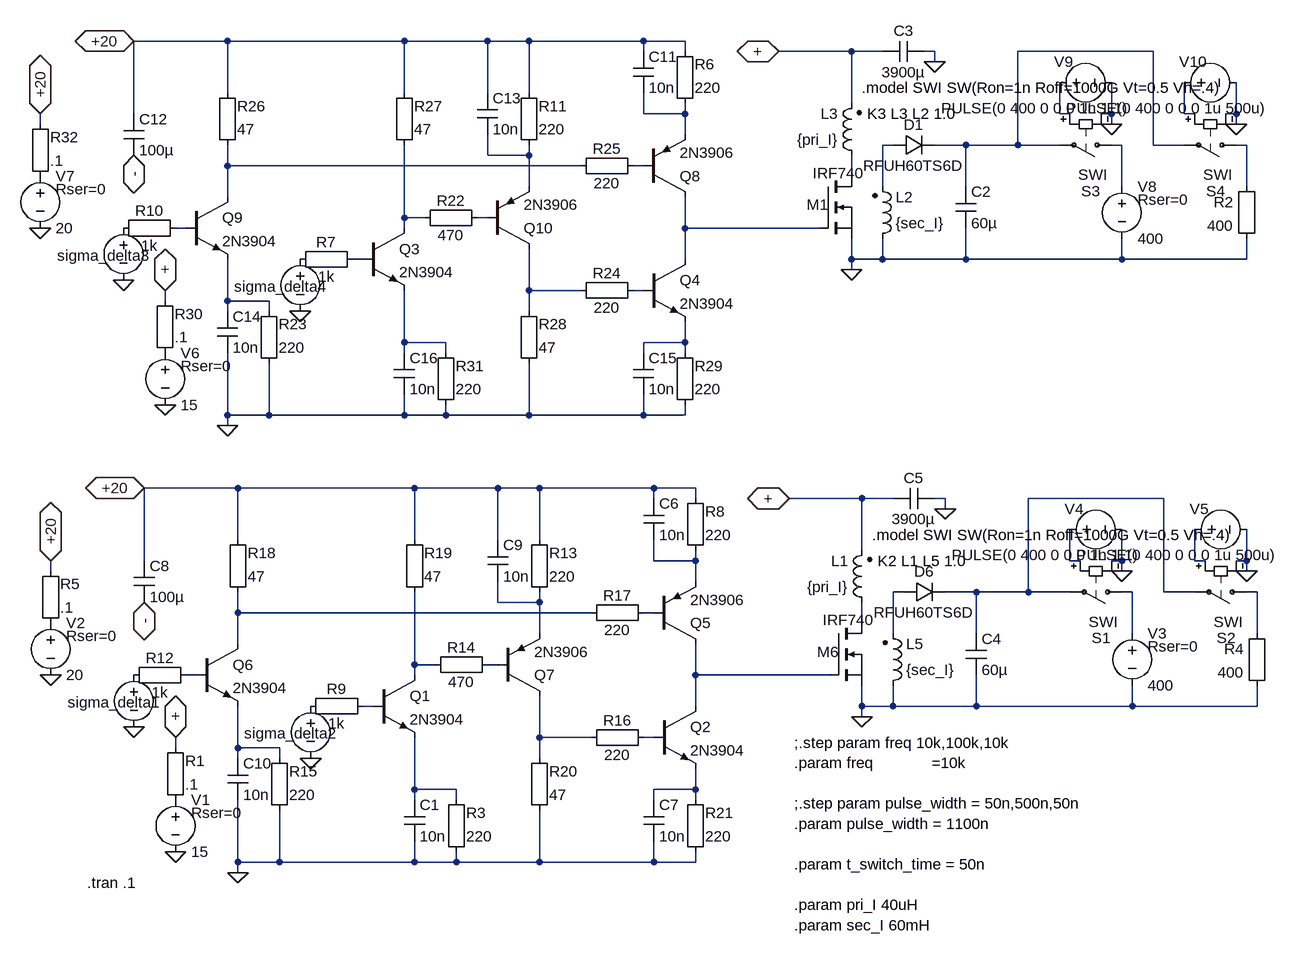
[diagram p0: schematic metal_SMPS_400v_60%_10khz_10.asc]
metal_SMPS_400v_60%_10khz_10.asc, the LTspice schematic file:
Version 4
SHEET 1 6068 1612
WIRE 2272 -3264 2128 -3264
WIRE 2544 -3264 2272 -3264
WIRE 2672 -3264 2544 -3264
WIRE 2736 -3264 2672 -3264
WIRE 2912 -3264 2736 -3264
WIRE 2976 -3264 2912 -3264
WIRE 2912 -3248 2912 -3264
WIRE 2976 -3248 2976 -3264
WIRE 3232 -3248 3120 -3248
WIRE 3280 -3248 3232 -3248
WIRE 3360 -3248 3344 -3248
WIRE 3696 -3248 3488 -3248
WIRE 3360 -3232 3360 -3248
WIRE 2272 -3184 2272 -3264
WIRE 2544 -3184 2544 -3264
WIRE 2672 -3184 2672 -3264
WIRE 2736 -3184 2736 -3264
WIRE 3232 -3168 3232 -3248
WIRE 2128 -3152 2128 -3264
WIRE 2912 -3152 2912 -3184
WIRE 2976 -3152 2976 -3168
WIRE 2976 -3152 2912 -3152
WIRE 3552 -3152 3552 -3200
WIRE 3568 -3152 3552 -3152
WIRE 3632 -3152 3632 -3200
WIRE 3632 -3152 3616 -3152
WIRE 3744 -3152 3744 -3200
WIRE 3760 -3152 3744 -3152
WIRE 3824 -3152 3824 -3200
WIRE 3824 -3152 3808 -3152
WIRE 1984 -3136 1984 -3152
WIRE 3632 -3136 3632 -3152
WIRE 3824 -3136 3824 -3152
WIRE 2976 -3120 2976 -3152
WIRE 3296 -3104 3280 -3104
WIRE 3408 -3104 3360 -3104
WIRE 3488 -3104 3488 -3248
WIRE 3488 -3104 3408 -3104
WIRE 3552 -3104 3488 -3104
WIRE 3648 -3104 3632 -3104
WIRE 3696 -3104 3696 -3248
WIRE 3744 -3104 3696 -3104
WIRE 3840 -3104 3824 -3104
WIRE 2672 -3088 2672 -3120
WIRE 2736 -3088 2736 -3104
WIRE 2736 -3088 2672 -3088
WIRE 2272 -3072 2272 -3104
WIRE 2816 -3072 2272 -3072
WIRE 2912 -3072 2896 -3072
WIRE 3232 -3056 3232 -3088
WIRE 2736 -3040 2736 -3088
WIRE 3280 -3040 3280 -3104
WIRE 3408 -3040 3408 -3104
WIRE 3648 -3040 3648 -3104
WIRE 3840 -3040 3840 -3104
WIRE 2272 -3024 2272 -3072
WIRE 2544 -2992 2544 -3104
WIRE 2576 -2992 2544 -2992
WIRE 2672 -2992 2656 -2992
WIRE 2208 -2976 2192 -2976
WIRE 2544 -2976 2544 -2992
WIRE 2976 -2976 2976 -3024
WIRE 3184 -2976 2976 -2976
WIRE 2480 -2928 2464 -2928
WIRE 2976 -2928 2976 -2976
WIRE 3232 -2928 3232 -2960
WIRE 3280 -2928 3280 -2960
WIRE 3280 -2928 3232 -2928
WIRE 3408 -2928 3408 -2976
WIRE 3408 -2928 3280 -2928
WIRE 3648 -2928 3648 -2960
WIRE 3648 -2928 3408 -2928
WIRE 3840 -2928 3840 -2960
WIRE 3840 -2928 3648 -2928
WIRE 3232 -2912 3232 -2928
WIRE 2736 -2880 2736 -2944
WIRE 2816 -2880 2736 -2880
WIRE 2912 -2880 2896 -2880
WIRE 2176 -2864 2176 -2880
WIRE 2272 -2864 2272 -2928
WIRE 2336 -2864 2272 -2864
WIRE 2272 -2848 2272 -2864
WIRE 2336 -2848 2336 -2864
WIRE 2736 -2848 2736 -2880
WIRE 2544 -2800 2544 -2880
WIRE 2608 -2800 2544 -2800
WIRE 2976 -2800 2976 -2832
WIRE 2976 -2800 2912 -2800
WIRE 2544 -2784 2544 -2800
WIRE 2608 -2784 2608 -2800
WIRE 2912 -2784 2912 -2800
WIRE 2976 -2784 2976 -2800
WIRE 2272 -2688 2272 -2784
WIRE 2336 -2688 2336 -2768
WIRE 2336 -2688 2272 -2688
WIRE 2544 -2688 2544 -2720
WIRE 2544 -2688 2336 -2688
WIRE 2608 -2688 2608 -2704
WIRE 2608 -2688 2544 -2688
WIRE 2736 -2688 2736 -2768
WIRE 2736 -2688 2608 -2688
WIRE 2912 -2688 2912 -2720
WIRE 2912 -2688 2736 -2688
WIRE 2976 -2688 2976 -2704
WIRE 2976 -2688 2912 -2688
WIRE 2272 -2672 2272 -2688
WIRE 2288 -2576 2144 -2576
WIRE 2560 -2576 2288 -2576
WIRE 2688 -2576 2560 -2576
WIRE 2752 -2576 2688 -2576
WIRE 2928 -2576 2752 -2576
WIRE 2992 -2576 2928 -2576
WIRE 2928 -2560 2928 -2576
WIRE 2992 -2560 2992 -2576
WIRE 3248 -2560 3136 -2560
WIRE 3296 -2560 3248 -2560
WIRE 3376 -2560 3360 -2560
WIRE 3712 -2560 3504 -2560
WIRE 3376 -2544 3376 -2560
WIRE 2288 -2496 2288 -2576
WIRE 2560 -2496 2560 -2576
WIRE 2688 -2496 2688 -2576
WIRE 2752 -2496 2752 -2576
WIRE 3248 -2480 3248 -2560
WIRE 2144 -2464 2144 -2576
WIRE 2928 -2464 2928 -2496
WIRE 2992 -2464 2992 -2480
WIRE 2992 -2464 2928 -2464
WIRE 3568 -2464 3568 -2512
WIRE 3584 -2464 3568 -2464
WIRE 3648 -2464 3648 -2512
WIRE 3648 -2464 3632 -2464
WIRE 3760 -2464 3760 -2512
WIRE 3776 -2464 3760 -2464
WIRE 3840 -2464 3840 -2512
WIRE 3840 -2464 3824 -2464
WIRE 2000 -2448 2000 -2464
WIRE 3648 -2448 3648 -2464
WIRE 3840 -2448 3840 -2464
WIRE 2992 -2432 2992 -2464
WIRE 3312 -2416 3296 -2416
WIRE 3424 -2416 3376 -2416
WIRE 3504 -2416 3504 -2560
WIRE 3504 -2416 3424 -2416
WIRE 3568 -2416 3504 -2416
WIRE 3664 -2416 3648 -2416
WIRE 3712 -2416 3712 -2560
WIRE 3760 -2416 3712 -2416
WIRE 3856 -2416 3840 -2416
WIRE 2688 -2400 2688 -2432
WIRE 2752 -2400 2752 -2416
WIRE 2752 -2400 2688 -2400
WIRE 2288 -2384 2288 -2416
WIRE 2832 -2384 2288 -2384
WIRE 2928 -2384 2912 -2384
WIRE 3248 -2368 3248 -2400
WIRE 2752 -2352 2752 -2400
WIRE 3296 -2352 3296 -2416
WIRE 3424 -2352 3424 -2416
WIRE 3664 -2352 3664 -2416
WIRE 3856 -2352 3856 -2416
WIRE 2288 -2336 2288 -2384
WIRE 2560 -2304 2560 -2416
WIRE 2592 -2304 2560 -2304
WIRE 2688 -2304 2672 -2304
WIRE 2224 -2288 2208 -2288
WIRE 2560 -2288 2560 -2304
WIRE 2992 -2288 2992 -2336
WIRE 3200 -2288 2992 -2288
WIRE 2496 -2240 2480 -2240
WIRE 2992 -2240 2992 -2288
WIRE 3248 -2240 3248 -2272
WIRE 3296 -2240 3296 -2272
WIRE 3296 -2240 3248 -2240
WIRE 3424 -2240 3424 -2288
WIRE 3424 -2240 3296 -2240
WIRE 3664 -2240 3664 -2272
WIRE 3664 -2240 3424 -2240
WIRE 3856 -2240 3856 -2272
WIRE 3856 -2240 3664 -2240
WIRE 3248 -2224 3248 -2240
WIRE 2752 -2192 2752 -2256
WIRE 2832 -2192 2752 -2192
WIRE 2928 -2192 2912 -2192
WIRE 2192 -2176 2192 -2192
WIRE 2288 -2176 2288 -2240
WIRE 2352 -2176 2288 -2176
WIRE 2288 -2160 2288 -2176
WIRE 2352 -2160 2352 -2176
WIRE 2752 -2160 2752 -2192
WIRE 2560 -2112 2560 -2192
WIRE 2624 -2112 2560 -2112
WIRE 2992 -2112 2992 -2144
WIRE 2992 -2112 2928 -2112
WIRE 2560 -2096 2560 -2112
WIRE 2624 -2096 2624 -2112
WIRE 2928 -2096 2928 -2112
WIRE 2992 -2096 2992 -2112
WIRE 2288 -2000 2288 -2096
WIRE 2352 -2000 2352 -2080
WIRE 2352 -2000 2288 -2000
WIRE 2560 -2000 2560 -2032
WIRE 2560 -2000 2352 -2000
WIRE 2624 -2000 2624 -2016
WIRE 2624 -2000 2560 -2000
WIRE 2752 -2000 2752 -2080
WIRE 2752 -2000 2624 -2000
WIRE 2928 -2000 2928 -2032
WIRE 2928 -2000 2752 -2000
WIRE 2992 -2000 2992 -2016
WIRE 2992 -2000 2928 -2000
WIRE 2288 -1984 2288 -2000
FLAG 3248 -2224 0
FLAG 3376 -2544 0
FLAG 3136 -2560 +
IOPIN 3136 -2560 BiDir
FLAG 2144 -2400 -
IOPIN 2144 -2400 BiDir
FLAG 2400 -2160 0
FLAG 2128 -2208 0
FLAG 2144 -2576 +20
IOPIN 2144 -2576 BiDir
FLAG 2288 -1984 0
FLAG 2192 -2192 +
IOPIN 2192 -2192 BiDir
FLAG 2192 -2016 0
FLAG 2000 -2464 +20
IOPIN 2000 -2464 BiDir
FLAG 2000 -2288 0
FLAG 3648 -2448 0
FLAG 3840 -2448 0
FLAG 3232 -2912 0
FLAG 3360 -3232 0
FLAG 3120 -3248 +
IOPIN 3120 -3248 BiDir
FLAG 2128 -3088 -
IOPIN 2128 -3088 BiDir
FLAG 2384 -2848 0
FLAG 2112 -2896 0
FLAG 2128 -3264 +20
IOPIN 2128 -3264 BiDir
FLAG 2272 -2672 0
FLAG 2176 -2880 +
IOPIN 2176 -2880 BiDir
FLAG 2176 -2704 0
FLAG 1984 -3152 +20
IOPIN 1984 -3152 BiDir
FLAG 1984 -2976 0
FLAG 3632 -3136 0
FLAG 3824 -3136 0
SYMBOL ind2 3280 -2256 M180
WINDOW 0 36 80 Left 2
WINDOW 3 36 40 Left 2
SYMATTR InstName L5
SYMATTR Value {sec_I}
SYMATTR SpiceLine Rser=.42
SYMATTR Type ind
SYMBOL diode 3312 -2400 R270
WINDOW 0 32 32 VTop 2
WINDOW 3 0 32 VBottom 2
SYMATTR InstName D6
SYMATTR Value RFUH60TS6D
SYMBOL Misc\\EuropeanCap 3408 -2352 R0
SYMATTR InstName C4
SYMATTR Value 60µ
SYMBOL Misc\\EuropeanResistor 3872 -2368 M0
SYMATTR InstName R4
SYMATTR Value 400
SYMBOL nmos 3200 -2368 R0
WINDOW 0 -21 44 Left 2
WINDOW 3 -12 -5 Left 2
SYMATTR InstName M6
SYMATTR Value IRF740
SYMBOL ind2 3264 -2384 R180
WINDOW 0 36 80 Left 2
WINDOW 3 36 40 Left 2
SYMATTR InstName L1
SYMATTR Value {pri_I}
SYMATTR SpiceLine Rser=.0003
SYMATTR Type ind
SYMBOL Misc\\EuropeanCap 3360 -2576 R90
WINDOW 0 0 32 VBottom 2
WINDOW 3 32 32 VTop 2
SYMATTR InstName C5
SYMATTR Value 3900µ
SYMATTR SpiceLine Rser=.005
SYMBOL Misc\\EuropeanCap 2912 -2560 R0
SYMATTR InstName C6
SYMATTR Value 10n
SYMATTR SpiceLine V=400 Irms=1 Rser=.32 Lser=0
SYMBOL Misc\\EuropeanResistor 2976 -2464 M180
WINDOW 0 31 76 Left 2
WINDOW 3 31 40 Left 2
SYMATTR InstName R8
SYMATTR Value 220
SYMBOL Misc\\EuropeanCap 2128 -2464 R0
SYMATTR InstName C8
SYMATTR Value 100µ
SYMATTR SpiceLine V=400 Irms=1 Rser=.32 Lser=0
SYMBOL npn3 2496 -2288 R0
SYMATTR InstName Q1
SYMATTR Value 2N3904
SYMBOL Misc\\EuropeanResistor 2384 -2256 M90
WINDOW 0 5 56 VBottom 2
WINDOW 3 27 56 VTop 2
SYMATTR InstName R9
SYMATTR Value 1k
SYMBOL npn3 2928 -2240 R0
SYMATTR InstName Q2
SYMATTR Value 2N3904
SYMBOL pnp2 2928 -2336 M180
SYMATTR InstName Q5
SYMATTR Value 2N3906
SYMBOL npn3 2224 -2336 R0
SYMATTR InstName Q6
SYMATTR Value 2N3904
SYMBOL Misc\\EuropeanResistor 2112 -2304 M90
WINDOW 0 5 56 VBottom 2
WINDOW 3 27 56 VTop 2
SYMATTR InstName R12
SYMATTR Value 1k
SYMBOL pnp2 2688 -2256 M180
SYMATTR InstName Q7
SYMATTR Value 2N3906
SYMBOL Misc\\EuropeanResistor 2736 -2400 M180
WINDOW 0 31 76 Left 2
WINDOW 3 31 40 Left 2
SYMATTR InstName R13
SYMATTR Value 220
SYMBOL Misc\\EuropeanResistor 2576 -2320 M90
WINDOW 0 5 56 VBottom 2
WINDOW 3 27 56 VTop 2
SYMATTR InstName R14
SYMATTR Value 470
SYMBOL Misc\\EuropeanCap 2672 -2496 R0
SYMATTR InstName C9
SYMATTR Value 10n
SYMATTR SpiceLine V=400 Irms=1 Rser=.32 Lser=0
SYMBOL Misc\\EuropeanResistor 2336 -2064 M180
WINDOW 0 31 76 Left 2
WINDOW 3 31 40 Left 2
SYMATTR InstName R15
SYMATTR Value 220
SYMBOL Misc\\EuropeanCap 2272 -2160 R0
SYMATTR InstName C10
SYMATTR Value 10n
SYMATTR SpiceLine V=400 Irms=1 Rser=.32 Lser=0
SYMBOL Misc\\EuropeanResistor 2928 -2176 M270
WINDOW 0 27 56 VTop 2
WINDOW 3 5 56 VBottom 2
SYMATTR InstName R16
SYMATTR Value 220
SYMBOL Misc\\EuropeanResistor 2816 -2400 M90
WINDOW 0 5 56 VBottom 2
WINDOW 3 27 56 VTop 2
SYMATTR InstName R17
SYMATTR Value 220
SYMBOL Misc\\EuropeanResistor 2272 -2400 M180
WINDOW 0 31 76 Left 2
WINDOW 3 31 40 Left 2
SYMATTR InstName R18
SYMATTR Value 47
SYMBOL Misc\\EuropeanResistor 2544 -2400 M180
WINDOW 0 31 76 Left 2
WINDOW 3 31 40 Left 2
SYMATTR InstName R19
SYMATTR Value 47
SYMBOL Misc\\EuropeanResistor 2736 -2064 M180
WINDOW 0 31 76 Left 2
WINDOW 3 31 40 Left 2
SYMATTR InstName R20
SYMATTR Value 47
SYMBOL Misc\\EuropeanCap 2912 -2096 R0
SYMATTR InstName C7
SYMATTR Value 10n
SYMATTR SpiceLine V=400 Irms=1 Rser=.32 Lser=0
SYMBOL Misc\\EuropeanResistor 2976 -2000 M180
WINDOW 0 31 76 Left 2
WINDOW 3 31 40 Left 2
SYMATTR InstName R21
SYMATTR Value 220
SYMBOL voltage 2128 -2304 M0
WINDOW 0 -42 58 Left 2
WINDOW 3 -134 119 Invisible 2
WINDOW 123 0 0 Left 2
SYMATTR InstName sigma_delta1
SYMATTR Value PULSE(0 5 0 10n 10n {t_switch_time} {1/freq})
SYMATTR SpiceLine Rser=0
SYMBOL voltage 2400 -2256 M0
WINDOW 0 -42 58 Left 2
WINDOW 3 -134 119 Invisible 2
WINDOW 123 0 0 Left 2
SYMATTR InstName sigma_delta2
SYMATTR Value PULSE(0 5 {pulse_width} 10n 10n {t_switch_time} {1/freq})
SYMATTR SpiceLine Rser=0
SYMBOL voltage 2192 -2112 R0
WINDOW 123 0 0 Left 2
WINDOW 39 24 36 Left 2
SYMATTR SpiceLine Rser=0
SYMATTR InstName V1
SYMATTR Value 15
SYMBOL Misc\\EuropeanResistor 2176 -2080 M180
WINDOW 0 31 76 Left 2
WINDOW 3 31 40 Left 2
SYMATTR InstName R1
SYMATTR Value .1
SYMBOL Misc\\EuropeanResistor 2608 -2000 M180
WINDOW 0 31 76 Left 2
WINDOW 3 31 40 Left 2
SYMATTR InstName R3
SYMATTR Value 220
SYMBOL Misc\\EuropeanCap 2544 -2096 R0
SYMATTR InstName C1
SYMATTR Value 10n
SYMATTR SpiceLine V=400 Irms=1 Rser=.32 Lser=0
SYMBOL voltage 2000 -2384 R0
WINDOW 123 0 0 Left 2
WINDOW 39 24 36 Left 2
SYMATTR SpiceLine Rser=0
SYMATTR InstName V2
SYMATTR Value 20
SYMBOL Misc\\EuropeanResistor 1984 -2352 M180
WINDOW 0 31 76 Left 2
WINDOW 3 31 40 Left 2
SYMATTR InstName R5
SYMATTR Value .1
SYMBOL sw 3664 -2416 R90
WINDOW 0 71 33 VRight 2
WINDOW 38 46 22 VRight 2
SYMATTR InstName S1
SYMATTR SpiceModel SWI
SYMATTR Value ""
SYMBOL voltage 3664 -2368 R0
WINDOW 123 0 0 Left 2
WINDOW 39 24 36 Left 2
SYMATTR SpiceLine Rser=0
SYMATTR InstName V3
SYMATTR Value 400
SYMBOL voltage 3552 -2512 R270
WINDOW 0 32 8 VRight 2
WINDOW 3 -39 -166 VRight 2
WINDOW 123 0 0 Left 2
SYMATTR InstName V4
SYMATTR Value PULSE(0 400 0 0 0 1n 1 1)
SYMATTR SpiceLine Rser=0
SYMBOL sw 3856 -2416 R90
WINDOW 0 71 33 VRight 2
WINDOW 38 46 22 VRight 2
SYMATTR InstName S2
SYMATTR SpiceModel SWI
SYMATTR Value ""
SYMBOL voltage 3744 -2512 R270
WINDOW 0 32 8 VRight 2
WINDOW 3 -39 -166 VRight 2
WINDOW 123 0 0 Left 2
SYMATTR InstName V5
SYMATTR Value PULSE(0 400 0 0 0 1u 500u)
SYMATTR SpiceLine Rser=0
SYMBOL ind2 3264 -2944 M180
WINDOW 0 36 80 Left 2
WINDOW 3 36 40 Left 2
SYMATTR InstName L2
SYMATTR Value {sec_I}
SYMATTR SpiceLine Rser=.42
SYMATTR Type ind
SYMBOL diode 3296 -3088 R270
WINDOW 0 32 32 VTop 2
WINDOW 3 0 32 VBottom 2
SYMATTR InstName D1
SYMATTR Value RFUH60TS6D
SYMBOL Misc\\EuropeanCap 3392 -3040 R0
SYMATTR InstName C2
SYMATTR Value 60µ
SYMBOL Misc\\EuropeanResistor 3856 -3056 M0
SYMATTR InstName R2
SYMATTR Value 400
SYMBOL nmos 3184 -3056 R0
WINDOW 0 -21 44 Left 2
WINDOW 3 -12 -5 Left 2
SYMATTR InstName M1
SYMATTR Value IRF740
SYMBOL ind2 3248 -3072 R180
WINDOW 0 36 80 Left 2
WINDOW 3 36 40 Left 2
SYMATTR InstName L3
SYMATTR Value {pri_I}
SYMATTR SpiceLine Rser=.0003
SYMATTR Type ind
SYMBOL Misc\\EuropeanCap 3344 -3264 R90
WINDOW 0 0 32 VBottom 2
WINDOW 3 32 32 VTop 2
SYMATTR InstName C3
SYMATTR Value 3900µ
SYMATTR SpiceLine Rser=.005
SYMBOL Misc\\EuropeanCap 2896 -3248 R0
SYMATTR InstName C11
SYMATTR Value 10n
SYMATTR SpiceLine V=400 Irms=1 Rser=.32 Lser=0
SYMBOL Misc\\EuropeanResistor 2960 -3152 M180
WINDOW 0 31 76 Left 2
WINDOW 3 31 40 Left 2
SYMATTR InstName R6
SYMATTR Value 220
SYMBOL Misc\\EuropeanCap 2112 -3152 R0
SYMATTR InstName C12
SYMATTR Value 100µ
SYMATTR SpiceLine V=400 Irms=1 Rser=.32 Lser=0
SYMBOL npn3 2480 -2976 R0
SYMATTR InstName Q3
SYMATTR Value 2N3904
SYMBOL Misc\\EuropeanResistor 2368 -2944 M90
WINDOW 0 5 56 VBottom 2
WINDOW 3 27 56 VTop 2
SYMATTR InstName R7
SYMATTR Value 1k
SYMBOL npn3 2912 -2928 R0
SYMATTR InstName Q4
SYMATTR Value 2N3904
SYMBOL pnp2 2912 -3024 M180
SYMATTR InstName Q8
SYMATTR Value 2N3906
SYMBOL npn3 2208 -3024 R0
SYMATTR InstName Q9
SYMATTR Value 2N3904
SYMBOL Misc\\EuropeanResistor 2096 -2992 M90
WINDOW 0 5 56 VBottom 2
WINDOW 3 27 56 VTop 2
SYMATTR InstName R10
SYMATTR Value 1k
SYMBOL pnp2 2672 -2944 M180
SYMATTR InstName Q10
SYMATTR Value 2N3906
SYMBOL Misc\\EuropeanResistor 2720 -3088 M180
WINDOW 0 31 76 Left 2
WINDOW 3 31 40 Left 2
SYMATTR InstName R11
SYMATTR Value 220
SYMBOL Misc\\EuropeanResistor 2560 -3008 M90
WINDOW 0 5 56 VBottom 2
WINDOW 3 27 56 VTop 2
SYMATTR InstName R22
SYMATTR Value 470
SYMBOL Misc\\EuropeanCap 2656 -3184 R0
SYMATTR InstName C13
SYMATTR Value 10n
SYMATTR SpiceLine V=400 Irms=1 Rser=.32 Lser=0
SYMBOL Misc\\EuropeanResistor 2320 -2752 M180
WINDOW 0 31 76 Left 2
WINDOW 3 31 40 Left 2
SYMATTR InstName R23
SYMATTR Value 220
SYMBOL Misc\\EuropeanCap 2256 -2848 R0
SYMATTR InstName C14
SYMATTR Value 10n
SYMATTR SpiceLine V=400 Irms=1 Rser=.32 Lser=0
SYMBOL Misc\\EuropeanResistor 2912 -2864 M270
WINDOW 0 27 56 VTop 2
WINDOW 3 5 56 VBottom 2
SYMATTR InstName R24
SYMATTR Value 220
SYMBOL Misc\\EuropeanResistor 2800 -3088 M90
WINDOW 0 5 56 VBottom 2
WINDOW 3 27 56 VTop 2
SYMATTR InstName R25
SYMATTR Value 220
SYMBOL Misc\\EuropeanResistor 2256 -3088 M180
WINDOW 0 31 76 Left 2
WINDOW 3 31 40 Left 2
SYMATTR InstName R26
SYMATTR Value 47
SYMBOL Misc\\EuropeanResistor 2528 -3088 M180
WINDOW 0 31 76 Left 2
WINDOW 3 31 40 Left 2
SYMATTR InstName R27
SYMATTR Value 47
SYMBOL Misc\\EuropeanResistor 2720 -2752 M180
WINDOW 0 31 76 Left 2
WINDOW 3 31 40 Left 2
SYMATTR InstName R28
SYMATTR Value 47
SYMBOL Misc\\EuropeanCap 2896 -2784 R0
SYMATTR InstName C15
SYMATTR Value 10n
SYMATTR SpiceLine V=400 Irms=1 Rser=.32 Lser=0
SYMBOL Misc\\EuropeanResistor 2960 -2688 M180
WINDOW 0 31 76 Left 2
WINDOW 3 31 40 Left 2
SYMATTR InstName R29
SYMATTR Value 220
SYMBOL voltage 2112 -2992 M0
WINDOW 0 -42 58 Left 2
WINDOW 3 -134 119 Invisible 2
WINDOW 123 0 0 Left 2
SYMATTR InstName sigma_delta3
SYMATTR Value PULSE(0 5 0 10n 10n {t_switch_time} {1/freq})
SYMATTR SpiceLine Rser=0
SYMBOL voltage 2384 -2944 M0
WINDOW 0 -42 58 Left 2
WINDOW 3 -134 119 Invisible 2
WINDOW 123 0 0 Left 2
SYMATTR InstName sigma_delta4
SYMATTR Value PULSE(0 5 {pulse_width} 10n 10n {t_switch_time} {1/freq})
SYMATTR SpiceLine Rser=0
SYMBOL voltage 2176 -2800 R0
WINDOW 123 0 0 Left 2
WINDOW 39 24 36 Left 2
SYMATTR SpiceLine Rser=0
SYMATTR InstName V6
SYMATTR Value 15
SYMBOL Misc\\EuropeanResistor 2160 -2768 M180
WINDOW 0 31 76 Left 2
WINDOW 3 31 40 Left 2
SYMATTR InstName R30
SYMATTR Value .1
SYMBOL Misc\\EuropeanResistor 2592 -2688 M180
WINDOW 0 31 76 Left 2
WINDOW 3 31 40 Left 2
SYMATTR InstName R31
SYMATTR Value 220
SYMBOL Misc\\EuropeanCap 2528 -2784 R0
SYMATTR InstName C16
SYMATTR Value 10n
SYMATTR SpiceLine V=400 Irms=1 Rser=.32 Lser=0
SYMBOL voltage 1984 -3072 R0
WINDOW 123 0 0 Left 2
WINDOW 39 24 36 Left 2
SYMATTR SpiceLine Rser=0
SYMATTR InstName V7
SYMATTR Value 20
SYMBOL Misc\\EuropeanResistor 1968 -3040 M180
WINDOW 0 31 76 Left 2
WINDOW 3 31 40 Left 2
SYMATTR InstName R32
SYMATTR Value .1
SYMBOL sw 3648 -3104 R90
WINDOW 0 71 33 VRight 2
WINDOW 38 46 22 VRight 2
SYMATTR InstName S3
SYMATTR SpiceModel SWI
SYMATTR Value ""
SYMBOL voltage 3648 -3056 R0
WINDOW 123 0 0 Left 2
WINDOW 39 24 36 Left 2
SYMATTR SpiceLine Rser=0
SYMATTR InstName V8
SYMATTR Value 400
SYMBOL voltage 3536 -3200 R270
WINDOW 0 32 8 VRight 2
WINDOW 3 -39 -166 VRight 2
WINDOW 123 0 0 Left 2
SYMATTR InstName V9
SYMATTR Value PULSE(0 400 0 0 0 1n 1 1)
SYMATTR SpiceLine Rser=0
SYMBOL sw 3840 -3104 R90
WINDOW 0 71 33 VRight 2
WINDOW 38 46 22 VRight 2
SYMATTR InstName S4
SYMATTR SpiceModel SWI
SYMATTR Value ""
SYMBOL voltage 3728 -3200 R270
WINDOW 0 32 8 VRight 2
WINDOW 3 -39 -166 VRight 2
WINDOW 123 0 0 Left 2
SYMATTR InstName V10
SYMATTR Value PULSE(0 400 0 0 0 1u 500u)
SYMATTR SpiceLine Rser=0
TEXT 3144 -2184 Left 2 !;.step param freq 10k,100k,10k\n.param freq             =10k\n \n;.step param pulse_width = 50n,500n,50n\n.param pulse_width = 1100n\n \n.param t_switch_time = 50n\n \n.param pri_I 40uH\n.param sec_I 60mH
TEXT 3272 -2464 Left 2 !K2 L1 L5 1.0
TEXT 2056 -1968 Left 2 !.tran .1
TEXT 3264 -2504 Left 2 !.model SWI SW(Ron=1n Roff=1000G Vt=0.5 Vh=.4)
TEXT 3256 -3152 Left 2 !K3 L3 L2 1.0
TEXT 3248 -3192 Left 2 !.model SWI SW(Ron=1n Roff=1000G Vt=0.5 Vh=.4)

The netlist it stands for:
* metal_SMPS_400v_60%_10khz_10.asc
L5 0 N026 {sec_I} Rser=.42
D6 N026 N022 RFUH60TS6D
C4 N022 0 60µ
R4 N028 0 400
M6 N032 N036 0 0 IRF740
L1 N032 + {pri_I} Rser=.0003
C5 0 + 3900µ Rser=.005
C6 +20 N023 10n V=400 Irms=1 Rser=.32 Lser=0
R8 N023 +20 220
C8 +20 - 100µ V=400 Irms=1 Rser=.32 Lser=0
Q1 N033 N037 N041 0 2N3904
R9 P001 N037 1k
Q2 N036 N039 N042 0 2N3904
Q5 N036 N031 N023 0 2N3906
Q6 N030 N035 N040 0 2N3904
R12 P002 N035 1k
Q7 N038 N034 N029 0 2N3906
R13 N029 +20 220
R14 N033 N034 470
C9 +20 N029 10n V=400 Irms=1 Rser=.32 Lser=0
R15 0 N040 220
C10 N040 0 10n V=400 Irms=1 Rser=.32 Lser=0
R16 N039 N038 220
R17 N030 N031 220
R18 N030 +20 47
R19 N033 +20 47
R20 0 N038 47
C7 N042 0 10n V=400 Irms=1 Rser=.32 Lser=0
R21 0 N042 220
V§sigma_delta1 P002 0 PULSE(0 5 0 10n 10n {t_switch_time} {1/freq}) Rser=0
V§sigma_delta2 P001 0 PULSE(0 5 {pulse_width} 10n 10n {t_switch_time} {1/freq}) Rser=0
V1 P003 0 15 Rser=0
R1 P003 + .1
R3 0 N041 220
C1 N041 0 10n V=400 Irms=1 Rser=.32 Lser=0
V2 P004 0 20 Rser=0
R5 P004 +20 .1
S1 N027 N022 N024 0 SWI
V3 N027 0 400 Rser=0
V4 N024 0 PULSE(0 400 0 0 0 1n 1 1) Rser=0
S2 N028 N022 N025 0 SWI
V5 N025 0 PULSE(0 400 0 0 0 1u 500u) Rser=0
L2 0 N005 {sec_I} Rser=.42
D1 N005 N001 RFUH60TS6D
C2 N001 0 60µ
R2 N007 0 400
M1 N011 N015 0 0 IRF740
L3 N011 + {pri_I} Rser=.0003
C3 0 + 3900µ Rser=.005
C11 +20 N002 10n V=400 Irms=1 Rser=.32 Lser=0
R6 N002 +20 220
C12 +20 - 100µ V=400 Irms=1 Rser=.32 Lser=0
Q3 N012 N016 N020 0 2N3904
R7 P005 N016 1k
Q4 N015 N018 N021 0 2N3904
Q8 N015 N010 N002 0 2N3906
Q9 N009 N014 N019 0 2N3904
R10 P006 N014 1k
Q10 N017 N013 N008 0 2N3906
R11 N008 +20 220
R22 N012 N013 470
C13 +20 N008 10n V=400 Irms=1 Rser=.32 Lser=0
R23 0 N019 220
C14 N019 0 10n V=400 Irms=1 Rser=.32 Lser=0
R24 N018 N017 220
R25 N009 N010 220
R26 N009 +20 47
R27 N012 +20 47
R28 0 N017 47
C15 N021 0 10n V=400 Irms=1 Rser=.32 Lser=0
R29 0 N021 220
V§sigma_delta3 P006 0 PULSE(0 5 0 10n 10n {t_switch_time} {1/freq}) Rser=0
V§sigma_delta4 P005 0 PULSE(0 5 {pulse_width} 10n 10n {t_switch_time} {1/freq}) Rser=0
V6 P007 0 15 Rser=0
R30 P007 + .1
R31 0 N020 220
C16 N020 0 10n V=400 Irms=1 Rser=.32 Lser=0
V7 P008 0 20 Rser=0
R32 P008 +20 .1
S3 N006 N001 N003 0 SWI
V8 N006 0 400 Rser=0
V9 N003 0 PULSE(0 400 0 0 0 1n 1 1) Rser=0
S4 N007 N001 N004 0 SWI
V10 N004 0 PULSE(0 400 0 0 0 1u 500u) Rser=0
.model D D
.lib standard.dio
.model NPN NPN
.model PNP PNP
.lib standard.bjt
.model NMOS NMOS
.model PMOS PMOS
.lib standard.mos
;.step param freq 10k,100k,10k
.param freq             =10k
;.step param pulse_width = 50n,500n,50n
.param pulse_width = 1100n
.param t_switch_time = 50n
.param pri_I 40uH
.param sec_I 60mH
K2 L1 L5 1.0
.tran .1
.model SWI SW(Ron=1n Roff=1000G Vt=0.5 Vh=.4)
K3 L3 L2 1.0
.model SWI SW(Ron=1n Roff=1000G Vt=0.5 Vh=.4)
.backanno
.end